# Altium project UZ_D_Template.PrjPCB (part 2 of 2)
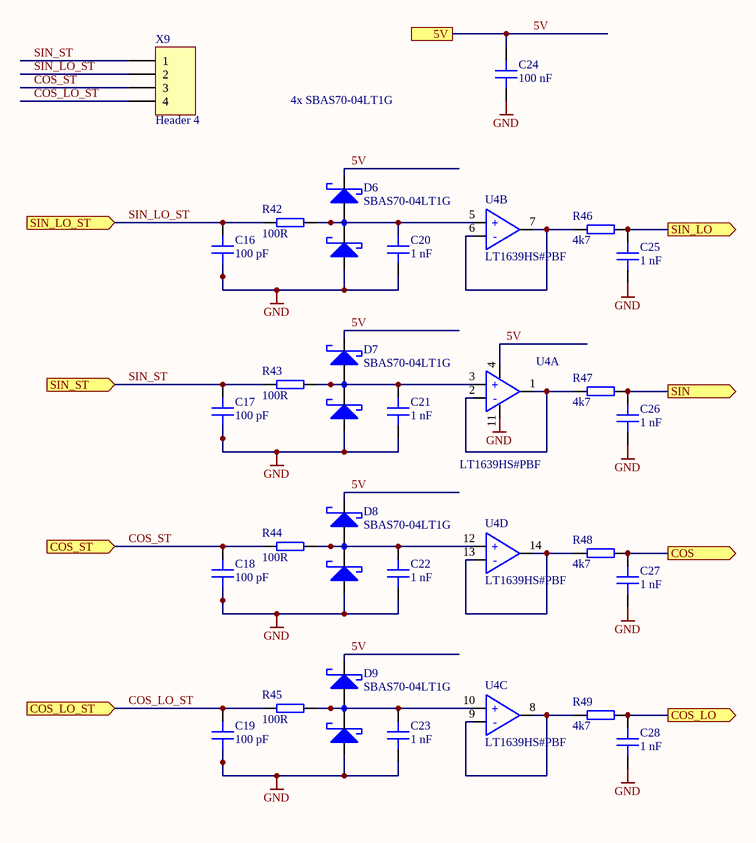
[diagram p5: Impedance converter.SchDoc]

## Nets that join several sheets
GND: DigitalCarrierJack (51 pins), U_Resolver1 (20 pins), U_Resolver1/Buffer_EXC (C11A.2 U2A.1 X8A.2 X8A.4), U_Resolver1/Impedance Converter (18 pins), U_Resolver2 (20 pins), U_Resolver2/Buffer_EXC (C11B.2 U2B.1 X8B.2 X8B.4), U_Resolver2/Impedance Converter (18 pins), U_Resolver3 (20 pins), U_Resolver3/Buffer_EXC (C11C.2 U2C.1 X8C.2 X8C.4), U_Resolver3/Impedance Converter (18 pins)
VIN_fused: DigitalCarrierJack (F1.2 R6.2), U_Resolver1 (X3A.2), U_Resolver1/Buffer_EXC (C11A.1 U2A.2), U_Resolver2 (X3B.2), U_Resolver2/Buffer_EXC (C11B.1 U2B.2), U_Resolver3 (X3C.2), U_Resolver3/Buffer_EXC (C11C.1 U2C.2)
5V_U_Resolver1: U_Resolver1 (7 pins), U_Resolver1/Impedance Converter (6 pins)
5V_U_Resolver2: U_Resolver2 (7 pins), U_Resolver2/Impedance Converter (6 pins)
5V_U_Resolver3: U_Resolver3 (7 pins), U_Resolver3/Impedance Converter (6 pins)
~{Reset_Resolver}: DigitalCarrierJack (X1.25), U_Resolver1 (R21A.1 U1A.33)
~{Reset_Resolver}: DigitalCarrierJack (X1.42), U_Resolver2 (R21B.1 U1B.33)
~{Reset_Resolver}: DigitalCarrierJack (X1.61), U_Resolver3 (R21C.1 U1C.33)
~{Resolver_CS}: DigitalCarrierJack (X1.30), U_Resolver1 (R9A.1 U1A.2)
~{Resolver_CS}: DigitalCarrierJack (X1.49), U_Resolver2 (R9B.1 U1B.2)
~{Resolver_CS}: DigitalCarrierJack (X1.66), U_Resolver3 (R9C.1 U1C.2)
A0_Resolver1: DigitalCarrierJack (X1.29), U_Resolver1 (R17A.1 R18A.2 TP1A.1 U1A.37)
A0_Resolver2: DigitalCarrierJack (X1.46), U_Resolver2 (R17B.1 R18B.2 TP1B.1 U1B.37)
A0_Resolver3: DigitalCarrierJack (X1.65), U_Resolver3 (R17C.1 R18C.2 TP1C.1 U1C.37)
A1_Resolver1: DigitalCarrierJack (X1.26), U_Resolver1 (R19A.1 R20A.2 TP2A.1 U1A.36)
A1_Resolver2: DigitalCarrierJack (X1.45), U_Resolver2 (R19B.1 R20B.2 TP2B.1 U1B.36)
A1_Resolver3: DigitalCarrierJack (X1.62), U_Resolver3 (R19C.1 R20C.2 TP2C.1 U1C.36)
COS_LO_ST: U_Resolver1 (X5A.6), U_Resolver1/Impedance Converter (C19A.1 R45A.1 X9A.4)
COS_LO_ST: U_Resolver2 (X5B.6), U_Resolver2/Impedance Converter (C19B.1 R45B.1 X9B.4)
COS_LO_ST: U_Resolver3 (X5C.6), U_Resolver3/Impedance Converter (C19C.1 R45C.1 X9C.4)
COS_LO_U_Resolver1: U_Resolver1 (TP4A.1 U1A.44), U_Resolver1/Impedance Converter (C28A.1 R49A.2)
COS_LO_U_Resolver2: U_Resolver2 (TP4B.1 U1B.44), U_Resolver2/Impedance Converter (C28B.1 R49B.2)
COS_LO_U_Resolver3: U_Resolver3 (TP4C.1 U1C.44), U_Resolver3/Impedance Converter (C28C.1 R49C.2)
COS_ST: U_Resolver1 (X5A.2), U_Resolver1/Impedance Converter (C18A.1 R44A.1 X9A.3)
COS_ST: U_Resolver2 (X5B.2), U_Resolver2/Impedance Converter (C18B.1 R44B.1 X9B.3)
COS_ST: U_Resolver3 (X5C.2), U_Resolver3/Impedance Converter (C18C.1 R44C.1 X9C.3)
COS_U_Resolver1: U_Resolver1 (TP3A.1 U1A.45), U_Resolver1/Impedance Converter (C27A.1 R48A.2)
COS_U_Resolver2: U_Resolver2 (TP3B.1 U1B.45), U_Resolver2/Impedance Converter (C27B.1 R48B.2)
COS_U_Resolver3: U_Resolver3 (TP3C.1 U1C.45), U_Resolver3/Impedance Converter (C27C.1 R48C.2)
D_EXC_N_U_Resolver1: U_Resolver1 (X5A.9), U_Resolver1/Buffer_EXC (5 pins)
D_EXC_N_U_Resolver2: U_Resolver2 (X5B.9), U_Resolver2/Buffer_EXC (5 pins)
D_EXC_N_U_Resolver3: U_Resolver3 (X5C.9), U_Resolver3/Buffer_EXC (5 pins)
D_EXC_U_Resolver1: U_Resolver1 (X5A.4), U_Resolver1/Buffer_EXC (5 pins)
D_EXC_U_Resolver2: U_Resolver2 (X5B.4), U_Resolver2/Buffer_EXC (5 pins)
D_EXC_U_Resolver3: U_Resolver3 (X5C.4), U_Resolver3/Buffer_EXC (5 pins)
D_SIN_LO_U_Resolver1: U_Resolver1 (X5A.7), U_Resolver1/Impedance Converter (C16A.1 R42A.1 X9A.2)
D_SIN_LO_U_Resolver2: U_Resolver2 (X5B.7), U_Resolver2/Impedance Converter (C16B.1 R42B.1 X9B.2)
D_SIN_LO_U_Resolver3: U_Resolver3 (X5C.7), U_Resolver3/Impedance Converter (C16C.1 R42C.1 X9C.2)
D_SIN_U_Resolver1: U_Resolver1 (X5A.3), U_Resolver1/Impedance Converter (C17A.1 R43A.1 X9A.1)
D_SIN_U_Resolver2: U_Resolver2 (X5B.3), U_Resolver2/Impedance Converter (C17B.1 R43B.1 X9B.1)
D_SIN_U_Resolver3: U_Resolver3 (X5C.3), U_Resolver3/Impedance Converter (C17C.1 R43C.1 X9C.1)
DIG_IO_00: DigitalCarrierJack (X1.17), U_Resolver1 (R14A.1 U1A.10)
DIG_IO_01: DigitalCarrierJack (X1.18), U_Resolver1 (U1A.12)
DIG_IO_02: DigitalCarrierJack (X1.21), U_Resolver1 (U1A.4)
DIG_IO_03: DigitalCarrierJack (X1.22), U_Resolver1 (U1A.13)
DIG_IO_08: DigitalCarrierJack (X1.33), U_Resolver1 (U1A.11)
DIG_IO_09: DigitalCarrierJack (X1.34), U_Resolver2 (R14B.1 U1B.10)
DIG_IO_10: DigitalCarrierJack (X1.37), U_Resolver2 (U1B.12)
DIG_IO_11: DigitalCarrierJack (X1.38), U_Resolver2 (U1B.4)
DIG_IO_12: DigitalCarrierJack (X1.41), U_Resolver2 (U1B.13)
DIG_IO_17: DigitalCarrierJack (X1.50), U_Resolver2 (U1B.11)
DIG_IO_18: DigitalCarrierJack (X1.53), U_Resolver3 (R14C.1 U1C.10)
DIG_IO_19: DigitalCarrierJack (X1.54), U_Resolver3 (U1C.12)
DIG_IO_20: DigitalCarrierJack (X1.57), U_Resolver3 (U1C.4)
DIG_IO_21: DigitalCarrierJack (X1.58), U_Resolver3 (U1C.13)
DIG_IO_26: DigitalCarrierJack (X1.69), U_Resolver3 (U1C.11)
EXC_U_Resolver1: U_Resolver1 (TP7A.1 U1A.38), U_Resolver1/Buffer_EXC (R27A.2 X6A.1)
EXC_U_Resolver2: U_Resolver2 (TP7B.1 U1B.38), U_Resolver2/Buffer_EXC (R27B.2 X6B.1)
EXC_U_Resolver3: U_Resolver3 (TP7C.1 U1C.38), U_Resolver3/Buffer_EXC (R27C.2 X6C.1)
GND_EXC_U_Resolver1: U_Resolver1 (6 pins), U_Resolver1/Buffer_EXC (11 pins)
GND_EXC_U_Resolver2: U_Resolver2 (6 pins), U_Resolver2/Buffer_EXC (11 pins)
GND_EXC_U_Resolver3: U_Resolver3 (6 pins), U_Resolver3/Buffer_EXC (11 pins)
N_EXC_U_Resolver1: U_Resolver1 (TP8A.1 U1A.39), U_Resolver1/Buffer_EXC (R26A.2 X6A.2)
N_EXC_U_Resolver2: U_Resolver2 (TP8B.1 U1B.39), U_Resolver2/Buffer_EXC (R26B.2 X6B.2)
N_EXC_U_Resolver3: U_Resolver3 (TP8C.1 U1C.39), U_Resolver3/Buffer_EXC (R26C.2 X6C.2)
SIN_LO_U_Resolver1: U_Resolver1 (TP6A.1 U1A.42), U_Resolver1/Impedance Converter (C25A.1 R46A.2)
SIN_LO_U_Resolver2: U_Resolver2 (TP6B.1 U1B.42), U_Resolver2/Impedance Converter (C25B.1 R46B.2)
SIN_LO_U_Resolver3: U_Resolver3 (TP6C.1 U1C.42), U_Resolver3/Impedance Converter (C25C.1 R46C.2)
SIN_U_Resolver1: U_Resolver1 (TP5A.1 U1A.41), U_Resolver1/Impedance Converter (C26A.1 R47A.2)
SIN_U_Resolver2: U_Resolver2 (TP5B.1 U1B.41), U_Resolver2/Impedance Converter (C26B.1 R47B.2)
SIN_U_Resolver3: U_Resolver3 (TP5C.1 U1C.41), U_Resolver3/Impedance Converter (C26C.1 R47C.2)